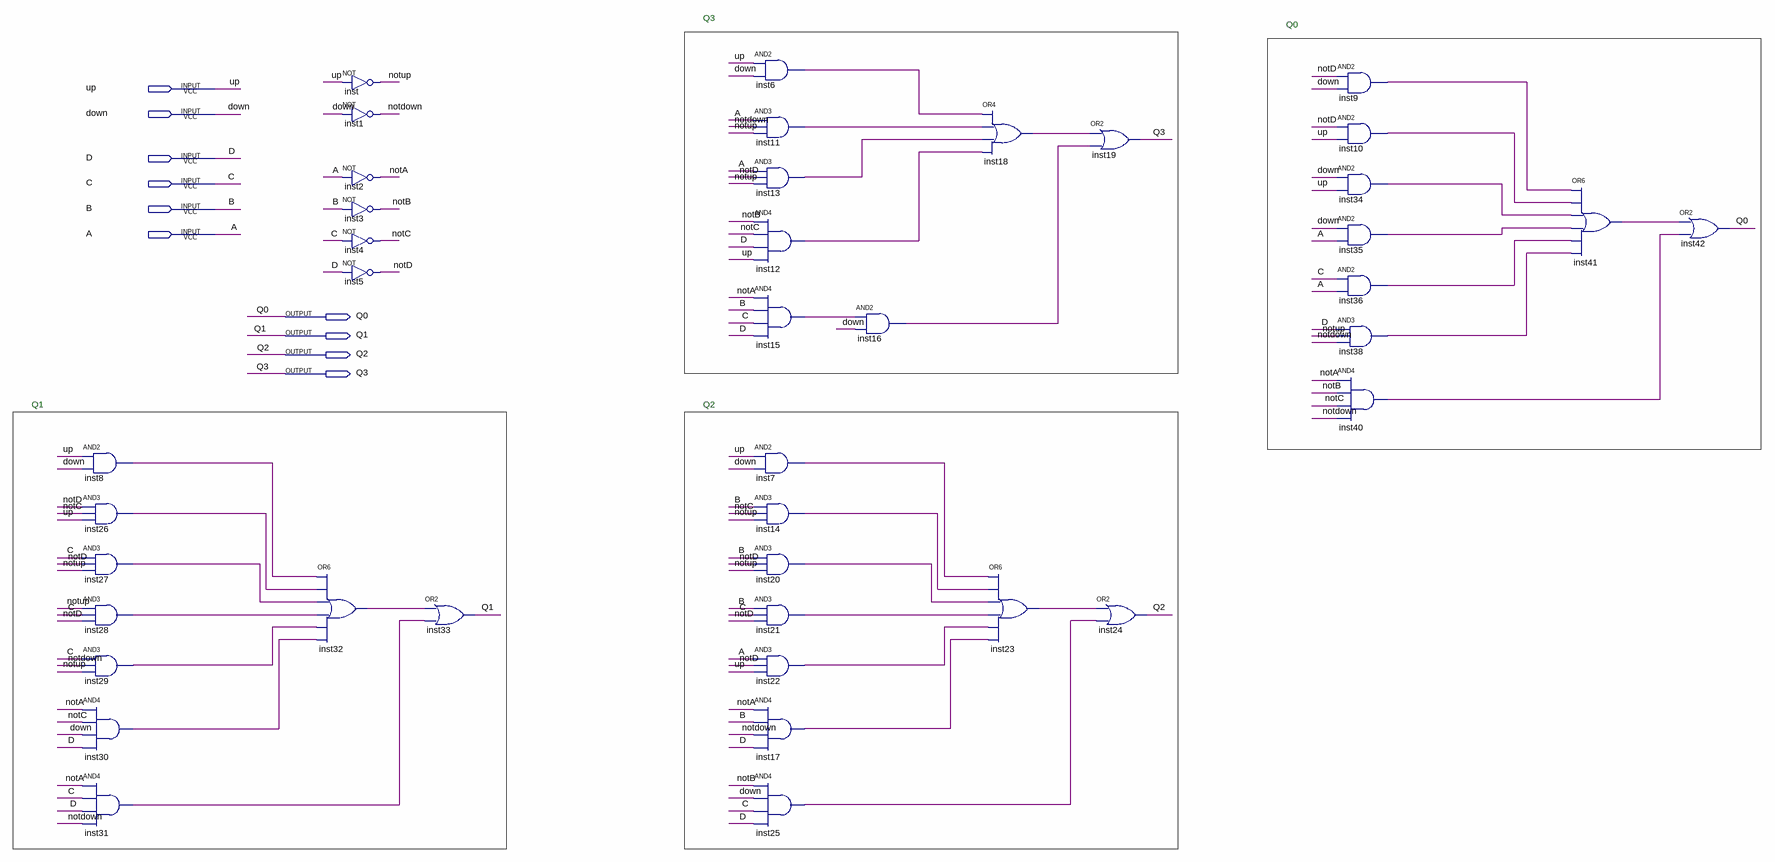
[diagram p0: schematic sheet]
// Quartus schematic entrada.bdf as structural Verilog: 41 symbols, 10 pins
module entrada (
  input  up,
  input  down,
  input  D,
  input  C,
  input  B,
  input  A,
  output Q0,
  output Q1,
  output Q2,
  output Q3
);

  wire inst6_out, inst7_out, inst8_out, inst9_out, inst10_out, inst11_out, inst12_out, inst13_out,
       inst14_out, inst15_out, inst16_out, inst17_out, inst18_out, inst20_out, inst21_out, inst22_out,
       inst23_out, inst25_out, inst26_out, inst27_out, inst28_out, inst29_out, inst30_out, inst31_out,
       inst32_out, inst34_out, inst35_out, inst36_out, inst38_out, inst40_out, inst41_out, notA, notB, notC,
       notD, notdown, notup;

  and inst8 (inst8_out, up, down);
  and inst26 (inst26_out, notD, notC, up);
  and inst27 (inst27_out, C, notD, notup);
  and inst28 (inst28_out, notup, C, notD);
  and inst29 (inst29_out, C, notdown, notup);
  and inst30 (inst30_out, notA, notC, down, D);
  and inst31 (inst31_out, notA, C, D, notdown);
  or inst32 (inst32_out, inst8_out, inst26_out, inst27_out, inst28_out, inst29_out, inst30_out);
  not inst (notup, up);
  not inst1 (notdown, down);
  not inst2 (notA, A);
  not inst3 (notB, B);
  not inst4 (notC, C);
  not inst5 (notD, D);
  or inst33 (Q1, inst32_out, inst31_out);
  and inst6 (inst6_out, up, down);
  and inst11 (inst11_out, A, notdown, notup);
  and inst13 (inst13_out, A, notD, notup);
  and inst12 (inst12_out, notB, notC, D, up);
  and inst15 (inst15_out, notA, B, C, D);
  and inst7 (inst7_out, up, down);
  and inst14 (inst14_out, B, notC, notup);
  and inst20 (inst20_out, B, notD, notup);
  and inst21 (inst21_out, B, C, notD);
  and inst22 (inst22_out, A, notD, up);
  and inst17 (inst17_out, notA, B, notdown, D);
  and inst25 (inst25_out, notB, down, C, D);
  and inst16 (inst16_out, inst15_out, down);
  or inst18 (inst18_out, inst6_out, inst11_out, inst13_out, inst12_out);
  or inst23 (inst23_out, inst7_out, inst14_out, inst20_out, inst21_out, inst22_out, inst17_out);
  or inst19 (Q3, inst18_out, inst16_out);
  or inst24 (Q2, inst23_out, inst25_out);
  and inst9 (inst9_out, notD, down);
  and inst10 (inst10_out, notD, up);
  and inst34 (inst34_out, down, up);
  and inst35 (inst35_out, down, A);
  and inst36 (inst36_out, C, A);
  and inst38 (inst38_out, D, notup, notdown);
  and inst40 (inst40_out, notA, notB, notC, notdown);
  or inst41 (inst41_out, inst9_out, inst10_out, inst34_out, inst35_out, inst36_out, inst38_out);
  or inst42 (Q0, inst41_out, inst40_out);

  // Notes on the sheet:
  //   Q3
  //   Q0
  //   Q1
  //   Q2
endmodule
